# EAGLE design tps63020-buck-boost-flashlight-driver-17mm-mk-1.0.1 (EAGLE 9.2.2)
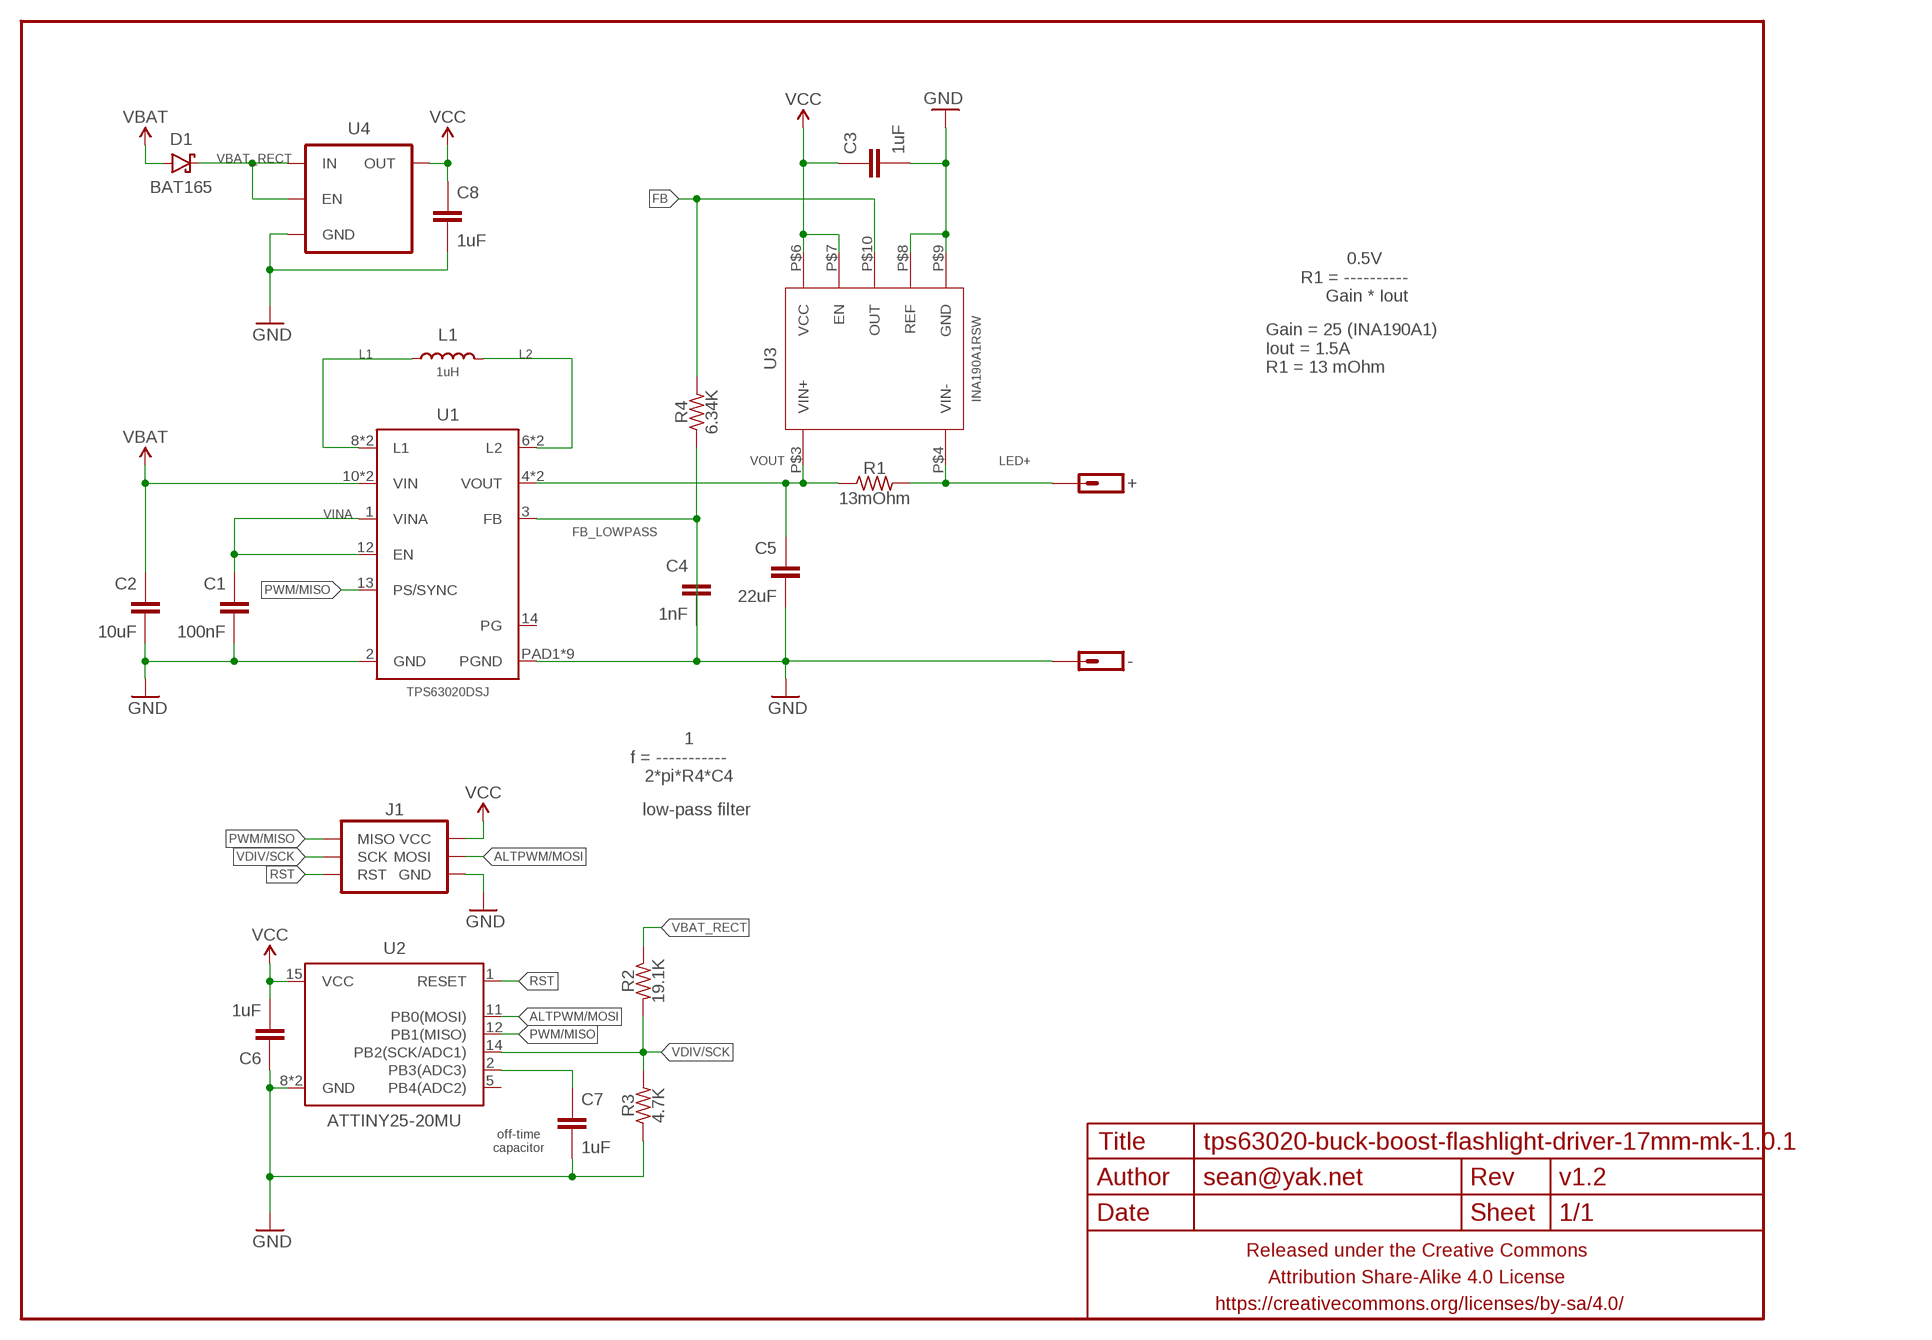
[diagram p0: schematic, sheet 1]

## Parts
+  M01PTH-1MM-CIR-NS  [1X01-1MM-CIR-NS]
-  M01PTH-1MM-CIR-NS  [1X01-1MM-CIR-NS]
C1  100nF  CAPACITOR-CERAMICC0402  [C0402]
C2  10uF  CAPACITOR-CERAMICC0805-TIGHTER  [C0805-TIGHTER]
C3  1uF  CAPACITOR-CERAMICC0402  [C0402]
C4  1nF  CAPACITOR-CERAMICC0402  [C0402]
C5  22uF  CAPACITOR-CERAMICC0805-TIGHTER  [C0805-TIGHTER]
C6  1uF  CAPACITOR-CERAMICC0402  [C0402]
C7  1uF  CAPACITOR-CERAMICC0402  [C0402]
C8  1uF  CAPACITOR-CERAMICC0402  [C0402]
D1  BAT165  DIODE-SCHOTTKYSOD323  [SOD323-SCHOTTKY]
FRAME1  FRAME-LETTERNO_PACKAGE  [DUMMY]
J1  AVR_SPI_PRG_6SMD-1.27MM  [2X3-1.27MM-SMD]
L1  1uH  INDUCTORXAL50X0  [XAL50X0]
R1  13mOhm  RESISTORR0805-TIGHTER  [R0805-TIGHTER]
R2  19.1K  RESISTORR0402  [R0402]
R3  4.7K  RESISTORR0402  [R0402]
R4  6.34K  RESISTORR0402  [R0402]
U1  TPS63020DSJ  [VSON-14-4MMX3MM]
U2  ATTINY25-20MU  ATTINY45TINY85-20-QFN  [QFN20]
U3  INA190A1RSW  INA190RSW  [UQFN-10]
U4  V_REG_ENTLV700  [SC70]

## Nets
ALTPWM/MOSI: J1.4(MOSI) U2.11(PB0(MOSI))
FB: R4.2 U3.P$10(OUT)
FB_LOWPASS: C4.2 R4.1 U1.3(FB)
GND: -.1 C1.2 C2.2 C3.2 C4.1 C5.2 C6.1 C7.2 C8.2 J1.6(GND) R3.1 U1.2(GND) U1.PAD1(PGND) U1.PAD2(PGND) U1.PAD3(PGND) U1.PAD4(PGND) U1.PAD5(PGND) U1.PAD6(PGND) U1.PAD7(PGND) U1.PAD8(PGND) U1.PADCENTER(PGND) U2.8(GND) U2.PAD(GND) U3.P$8(REF) U3.P$9(GND) U4.2(GND)
L1: L1.P$1 U1.8(L1) U1.9(L1)
L2: L1.P$2 U1.6(L2) U1.7(L2)
LED+: +.1 R1.2 U3.P$4(VIN-)
N$5: C7.1 U2.2(PB3(ADC3))
PWM/MISO: J1.1(MISO) U1.13(PS/SYNC) U2.12(PB1(MISO))
RST: J1.5(RST) U2.1(RESET)
VBAT: C2.1 D1.A U1.10(VIN) U1.11(VIN)
VBAT_RECT: D1.C R2.1 U4.1(IN) U4.3(EN)
VCC: C3.1 C6.2 C8.1 J1.2(VCC) U2.15(VCC) U3.P$6(VCC) U3.P$7(EN) U4.5(OUT)
VDIV/SCK: J1.3(SCK) R2.2 R3.2 U2.14(PB2(SCK/ADC1))
VINA: C1.1 U1.1(VINA) U1.12(EN)
VOUT: C5.1 R1.1 U1.4(VOUT) U1.5(VOUT) U3.P$3(VIN+)
Unconnected: U1.14(PG) U2.5(PB4(ADC2))

## Notes on the sheet
- 0.5V
  R1 = ----------
       Gain * Iout
- Gain = 25 (INA190A1)
  Iout = 1.5A
  R1 = 13 mOhm
- 1
  f = -----------
      2*pi*R4*C4
- low-pass filter
- off-time
  capacitor

## Library data of the parts
+ - = a_parts:M01: Header 1 Standard 1-pin 0.1" header. Use with straight break away headers (SKU : PRT-00116), right angle break away headers (PRT-00553), swiss pins (PRT-00743), machine pins (PRT-00117), and female headers (PRT-00115).
C1-C8 = a_parts:CAPACITOR-CERAMIC: CAPACITOR, European symbol
D1 = a_parts:DIODE-SCHOTTKY: Schottky diodes in SFE's production catalog BAT20J 1A 23V 0.62Vf RB751 120mA 40V 0.37Vf PMEG4005EJ 0.5A 40V 0.42Vf MBRA140 1A 40V 0.5Vf B340A 3A 40V SMA
FRAME1 = a_parts:FRAME-LETTER: Schematic Frame Standard 8.5x11 US Letter frame; DESIGNER: sean@yak.net; VERSION: v1.2
J1 = a_parts:AVR_SPI_PRG_6: AVR ISP 6 Pin This is the reduced ISP connector for AVR programming. Common on Arduino. This footprint will take up less PCB space and can be used with a 10-pin to 6-pin adapter such as SKU: BOB-08508 **Special note about "TEST_POINT" package. The stop mask is on the top side, so if you want your programming test points to be on the bottom of your board, make sure to place this package on the bottom side of the board. This also ensure that the orientation to program from the bottom side will be correct.
L1 = a_parts:INDUCTOR: Inductors Basic Inductor/Choke - 0603 and 1206. Footprints are not proven and vary greatly between part numbers. SRN6045- 33uH, 20% 1.4A SDR0403-560KL - 56uH, 10%, 500mA RMS/740mA peak
R1-R4 = a_parts:RESISTOR: RESISTOR, American symbol
U1 = a_parts:TPS63020
U2 = a_parts:ATTINY45: Atmel 8-pin 2/4/8kB flash uC
U3 = a_parts:INA190
U4 = a_parts:V_REG_EN

## Board
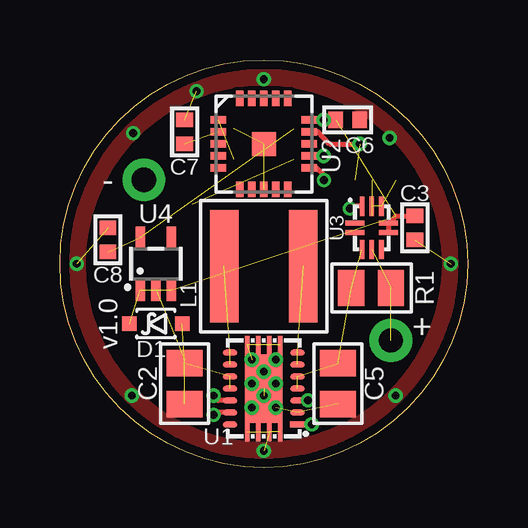
[diagram p1: board, top side]
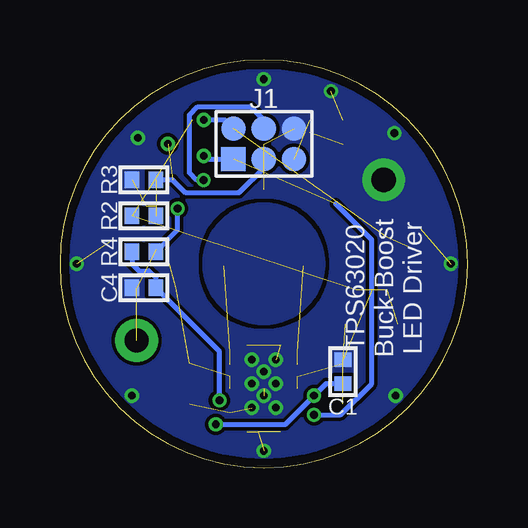
[diagram p2: board, bottom side, seen from below]

Size 17 x 17 mm. Coordinates in mm from the lower left corner, seen from the top.
Outline: 0,8.5 arc-180 17,8.5 arc-180 0,8.5
Copper layers (1*16): Top 0.035559375mm / dielectric 1.6mm / Bottom 0.035559375mm
Design rules "oshpark-2layer": minimum track width 6mil, minimum drill 10mil, track to track 6mil, track to pad 6mil, pad to pad 6mil, via to via 6mil, smd to smd 0mil, copper to edge 15mil, drill to drill 6mil, minimum pad ring 5mil, minimum via ring 5mil, stop-mask expansion 2.5mil, vias tented up to drill 20mil, thermal gap 10mil

### Footprints (pad centres in the part's own frame; a part is rotated, then mirrored left to right if it is on the bottom)
1X01-1MM-CIR-NS = drill 1.016 pad 1.778: 1 0,0
C0402 = smd 0.6 x 0.7: 1 -0.5,0; 2 0.5,0
C0805-TIGHTER = smd 1.1 x 1.5: 1 -0.85,0; 2 0.85,0
SOD323-SCHOTTKY = smd 0.6 x 0.6: A -1.1,0; C 1.1,0
2X3-1.27MM-SMD = smd 1.016 x 1.016: 1 -1.27,-0.635; 2 -1.27,0.635; 3 0,-0.635; 4 0,0.635; 5 1.27,-0.635; 6 1.27,0.635
XAL50X0 = smd 1.18 x 4.7: P$1 -1.651,0; P$2 1.651,0
R0805-TIGHTER = smd 1.1 x 1.5: 1 -0.85,0; 2 0.8,0
R0402 = smd 0.6 x 0.7: 1 -0.5,0; 2 0.5,0
VSON-14-4MMX3MM = smd 0.24 x 0.6: 1 -1.5,-1.4; 2 -1,-1.4; 3 -0.5,-1.4; 4 0,-1.4; 5 0.5,-1.4; 6 1,-1.4; 7 1.5,-1.4; 8 1.5,1.4; 9 1,1.4; 10 0.5,1.4; 11 0,1.4; 12 -0.5,1.4; 13 -1,1.4; 14 -1.5,1.4 | smd 0.775 x 0.2: PAD1 -1.812,0.69; PAD2 -1.812,0.23; PAD3 -1.812,-0.23; PAD4 -1.812,-0.69; PAD5 1.812,-0.69; PAD6 1.812,-0.23; PAD7 1.812,0.23; PAD8 1.812,0.69 | smd 2.85 x 1.58: PADCENTER 0,0
QFN20 = smd 0.65 x 0.3: 1 -1.9,1; 2 -1.9,0.5; 3 -1.9,0; 4 -1.9,-0.5; 5 -1.9,-1; 11 1.9,-1; 12 1.9,-0.5; 13 1.9,0; 14 1.9,0.5; 15 1.9,1 | smd 0.3 x 0.65: 6 -1,-1.9; 7 -0.5,-1.9; 8 0,-1.9; 9 0.5,-1.9; 10 1,-1.9; 16 1,1.9; 17 0.5,1.9; 18 0,1.9; 19 -0.5,1.9; 20 -1,1.9 | smd 1 x 1: PAD 0,0
UQFN-10 = smd 0.2 x 0.8: P$1 -0.2,-0.7; P$2 0.2,-0.7; P$6 0.2,0.7; P$7 -0.2,0.7 | smd 0.8 x 0.2: P$3 0.9,-0.4; P$4 0.9,0; P$5 0.9,0.4; P$8 -0.9,0.4; P$9 -0.9,0; P$10 -0.9,-0.4
SC70 = smd 0.4 x 0.9: 1 -0.65,-1.1; 2 0,-1.1; 3 0.65,-1.1; 4 0.65,1.1; 5 -0.65,1.1

### Placement (x,y rotation side)
+  13.8,5.3 0 top
-  3.5,12 270 top
C1  5.2,4 90 bottom
C2  5.2,3.5 270 top
C3  14.8,10 270 top
C4  13.5,7.5 0 bottom
C5  11.6,3.5 270 top
C6  12,14.5 180 top
C7  5.2,14 90 top
C8  2,9.5 90 top
D1  4,6 180 top
FRAME1  -0.5,-0.5 0 top
J1  8.5,13.5 0 bottom
L1  8.5,8.4 0 top
R1  13,7.5 0 top
R2  13.5,10.5 0 bottom
R3  13.5,12 0 bottom
R4  13.5,9 0 bottom
U1  8.5,3.3 90 top
U2  8.5,13.5 0 top
U3  13,10 270 top
U4  4,8.5 0 top

### Tracks (layer width: path | path; a pad name or v marks a point on that pad's centre or on a via)
ALTPWM/MOSI  (via drill 0.33)
  Top 0.2: U2.11 10.7,12.5 11,12.2 v11,12
  Bottom 0.2: v11,12 11.3,12 11.6,12.3 11.6,14.7 11.26,15.04 9.04,15.04 8.5,14.5 J1.4
FB  (via drill 0.33)
  Top 0.2: U3.P$10 12.2,10.9 v12.1,10.8
  Bottom 0.2: R4.2 12.1,9.9 v12.1,10.8
FB_LOWPASS  (via drill 0.33)
  Top 0.2: U1.3 v10.35,2.8
  Bottom 0.2: v10.35,2.8 10.35,4.85 12.1,6.6 C4.2 13,7.9 13.3,8.2 13.7,8.2 14,8.5 R4.1
GND  (via drill 0.33)  (20 unrouted)
  other vias: 8,2.5 8,3.5 8,4.5 9,2.5 9,3.5 9,4.5 8.5,3 8.5,4 8.5,0.7 0.7,8.5 16.3,8.5 8.5,16.2 13.75,13.75 3.05,13.95 14,3 3,3 5.7,15.7
  pour Top (isolate 0.152, rank 6, no thermals): 0,8.5 arc90 8.5,0 arc90 17,8.5 16,8.5 arc-90 8.5,1 arc-90 1,8.5
  pour Bottom (isolate 0.152, rank 6, no thermals): 8.5,0 arc-90 0,8.5 arc-90 8.5,17 arc-90 17,8.5 arc-90
  pour Top (isolate 0.152, rank 6, no thermals): 17,8.5 arc90 8.5,17 arc90 0,8.5 1,8.5 arc-90 8.5,16 arc-90 16,8.5
L1  (2 unrouted)
L2  (2 unrouted)
LED+  (2 unrouted)
N$5  (1 unrouted)
PWM/MISO  (via drill 0.33)  (1 unrouted)
  Top 0.2: U2.12 v11,13 | U1.13 6.5,2.3 v6.4,2.2
  Bottom 0.2: v11,13 10.87,12.87 J1.1 | v6.4,2.2 5.3,2.2 4,3.5 4,9.5 5.5,11
RST  (1 unrouted)
VBAT  (3 unrouted)
  pour Bottom (isolate 0.152, no thermals): 6,8.5 arc-180 11,8.5 arc-180
VBAT_RECT  (3 unrouted)
VCC  (via drill 0.33)  (3 unrouted)
  Top 0.2: U3.P$6 U3.P$7 14,10.5 C3.1 | U2.15 v11,14.5 C6.2
  Bottom 0.2: J1.2 10.13,14.5 v11,14.5
VDIV/SCK  (via drill 0.33)  (2 unrouted)
  Top 0.2: v12.5,13.5 11.24,13.5 10.77,14 U2.14
  Bottom 0.2: J1.3 8.5,12.5 9.55,11.45 11.75,11.45 12.3,12 R3.2
VINA  (via drill 0.33)
  Top 0.2: U1.12 6.6,2.8 v6.4,3 | U1.1 v10.5,1.8
  Bottom 0.2: C1.1 5.9,3.5 v6.4,3 7.6,1.8 v10.5,1.8
VOUT  (4 unrouted)

### Text on the board
bPlace: TPS63020 / Buck-Boost / LED Driver